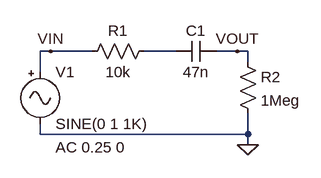
[diagram p0: schematic RC_IN.asc]
RC_IN.asc, the LTspice schematic file:
Version 4
SHEET 1 880 680
WIRE 0 144 -16 144
WIRE 64 144 0 144
WIRE 192 144 144 144
WIRE 288 144 256 144
WIRE 304 144 288 144
WIRE 304 160 304 144
WIRE -16 176 -16 144
WIRE -16 272 -16 256
WIRE 304 272 304 240
WIRE 304 272 -16 272
WIRE 304 288 304 272
FLAG 304 288 0
FLAG 0 144 VIN
FLAG 288 144 VOUT
SYMBOL res 160 128 R90
WINDOW 0 0 56 VBottom 2
WINDOW 3 32 56 VTop 2
SYMATTR InstName R1
SYMATTR Value 10k
SYMBOL cap 256 128 R90
WINDOW 0 0 32 VBottom 2
WINDOW 3 32 32 VTop 2
SYMATTR InstName C1
SYMATTR Value 47n
SYMBOL res 288 144 R0
SYMATTR InstName R2
SYMATTR Value 1Meg
SYMBOL Misc\\signal -16 160 R0
WINDOW 123 24 132 Left 2
WINDOW 39 0 0 Left 0
SYMATTR InstName V1
SYMATTR Value2 AC 0.25 0

The netlist it stands for:
* RC_IN.asc
R1 N001 VIN 10k
C1 VOUT N001 47n
R2 VOUT 0 1Meg
V1 VIN 0 SINE(0 1 1K) AC 0.25 0
.backanno
.end